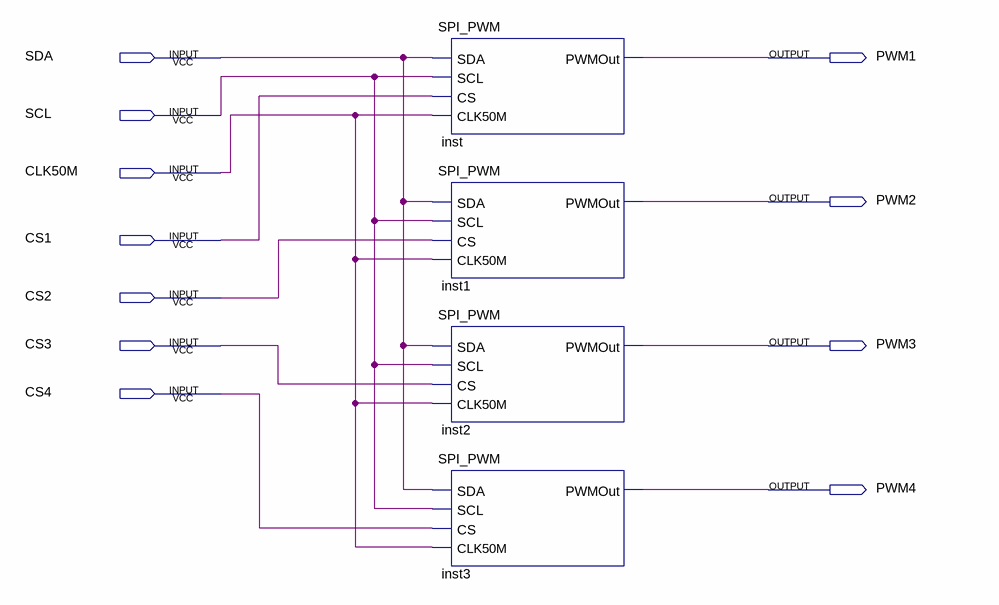
[diagram p0: schematic sheet]
// Quartus schematic PWM_4CHs.bdf as structural Verilog: 4 symbols, 11 pins
module PWM_4CHs (
  input  SDA,
  input  SCL,
  input  CLK50M,
  input  CS1,
  input  CS2,
  input  CS3,
  input  CS4,
  output PWM1,
  output PWM2,
  output PWM3,
  output PWM4
);

  SPI_PWM inst (.SDA(SDA), .SCL(SCL), .CS(CS1), .CLK50M(CLK50M), .PWMOut(PWM1));
  SPI_PWM inst1 (.SDA(SDA), .SCL(SCL), .CS(CS2), .CLK50M(CLK50M), .PWMOut(PWM2));
  SPI_PWM inst2 (.SDA(SDA), .SCL(SCL), .CS(CS3), .CLK50M(CLK50M), .PWMOut(PWM3));
  SPI_PWM inst3 (.SDA(SDA), .SCL(SCL), .CS(CS4), .CLK50M(CLK50M), .PWMOut(PWM4));
endmodule
